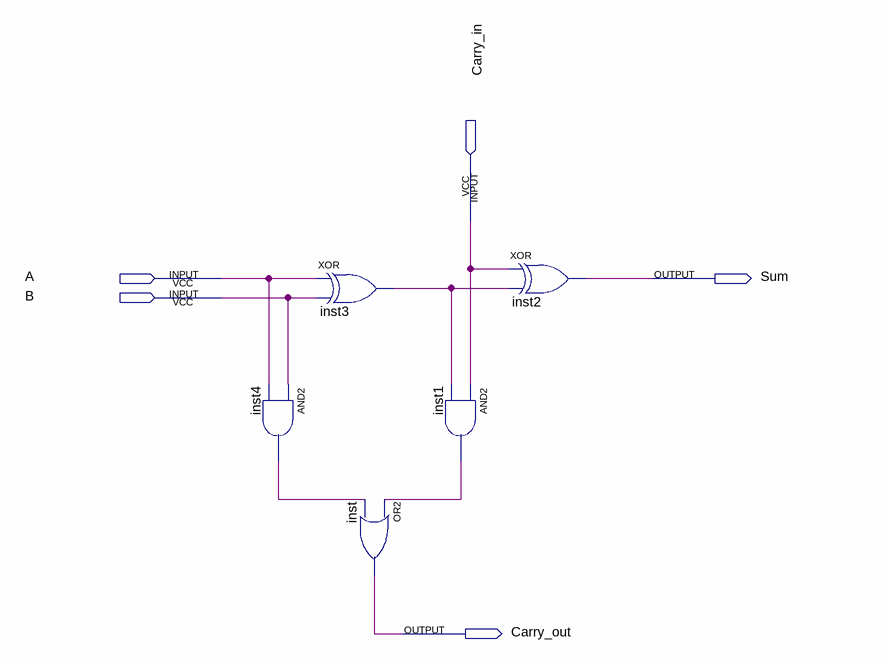
[diagram p0: schematic sheet]
// Quartus schematic Full_Adder_1bit.bdf as structural Verilog: 5 symbols, 5 pins
module Full_Adder_1bit (
  input  Carry_in,
  input  A,
  input  B,
  output Sum,
  output Carry_out
);

  wire inst1_out, inst3_out, inst4_out;

  and inst4 (inst4_out, B, A);
  xor inst3 (inst3_out, A, B);
  or inst (Carry_out, inst1_out, inst4_out);
  and inst1 (inst1_out, Carry_in, inst3_out);
  xor inst2 (Sum, Carry_in, inst3_out);
endmodule
